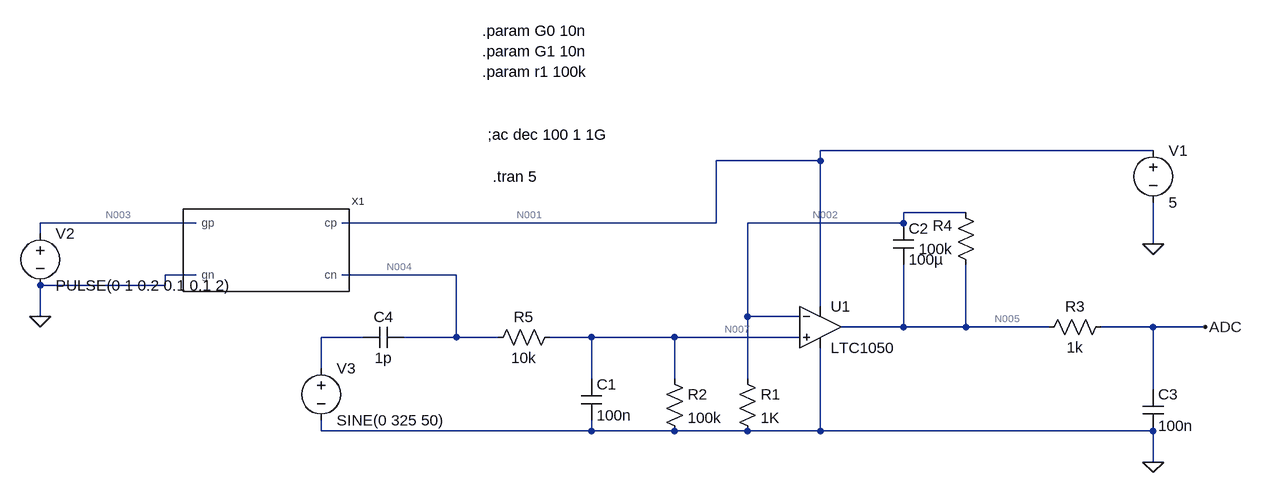
[diagram p0: schematic projet_symbol.asc]
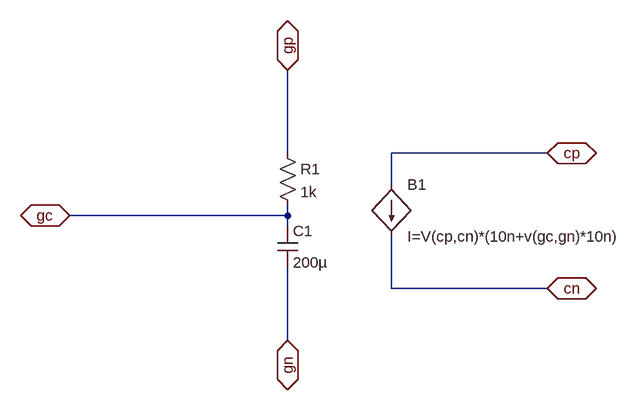
[diagram p1: sub-circuit symbole.asc]
projet_symbol.asc, the LTspice schematic file:
Version 4
SHEET 1 880 680
WIRE 720 -112 208 -112
WIRE 208 -96 208 -112
WIRE 208 -96 48 -96
WIRE 432 -16 336 -16
WIRE -752 0 -992 0
WIRE 48 0 48 -96
WIRE 48 0 -528 0
WIRE 336 0 336 -16
WIRE 336 0 96 0
WIRE -992 16 -992 0
WIRE 720 32 720 -32
WIRE -752 80 -800 80
WIRE -352 80 -528 80
WIRE -800 96 -800 80
WIRE -800 96 -992 96
WIRE 208 128 208 -96
WIRE -992 144 -992 96
WIRE 96 144 96 0
WIRE 176 144 96 144
WIRE 336 160 336 64
WIRE 336 160 240 160
WIRE 432 160 432 64
WIRE 432 160 336 160
WIRE 560 160 432 160
WIRE 720 160 640 160
WIRE 800 160 720 160
WIRE -496 176 -560 176
WIRE -352 176 -352 80
WIRE -352 176 -432 176
WIRE -288 176 -352 176
WIRE -144 176 -208 176
WIRE -16 176 -144 176
WIRE 176 176 -16 176
WIRE -560 224 -560 176
WIRE -144 240 -144 176
WIRE -16 240 -16 176
WIRE 96 240 96 144
WIRE 720 256 720 160
WIRE -560 320 -560 304
WIRE -144 320 -144 304
WIRE -144 320 -560 320
WIRE -16 320 -144 320
WIRE 96 320 -16 320
WIRE 208 320 208 192
WIRE 208 320 96 320
WIRE 720 320 208 320
WIRE 720 368 720 320
FLAG 720 368 0
FLAG 720 32 0
FLAG 800 160 ADC
FLAG -992 144 0
SYMBOL OpAmps\\LTC1050 208 96 R0
SYMATTR InstName U1
SYMBOL res 80 224 R0
SYMATTR InstName R1
SYMATTR Value 1K
SYMBOL res -32 224 R0
SYMATTR InstName R2
SYMATTR Value 100k
SYMBOL res 656 144 R90
WINDOW 0 0 56 VBottom 2
WINDOW 3 32 56 VTop 2
SYMATTR InstName R3
SYMATTR Value 1k
SYMBOL res 448 80 R180
WINDOW 0 36 76 Left 2
WINDOW 3 36 40 Left 2
SYMATTR InstName R4
SYMATTR Value 100k
SYMBOL res -304 192 R270
WINDOW 0 32 56 VTop 2
WINDOW 3 0 56 VBottom 2
SYMATTR InstName R5
SYMATTR Value 10k
SYMBOL cap -160 240 R0
SYMATTR InstName C1
SYMATTR Value 100n
SYMBOL cap 320 0 R0
SYMATTR InstName C2
SYMATTR Value 100µ
SYMBOL cap 704 256 R0
SYMATTR InstName C3
SYMATTR Value 100n
SYMBOL voltage 720 -128 R0
WINDOW 123 0 0 Left 0
WINDOW 39 0 0 Left 0
SYMATTR InstName V1
SYMATTR Value 5
SYMBOL voltage -992 0 R0
WINDOW 123 0 0 Left 0
WINDOW 39 0 0 Left 0
SYMATTR InstName V2
SYMATTR Value PULSE(0 1 0.2 0.1 0.1 2)
SYMBOL voltage -560 208 R0
WINDOW 123 0 0 Left 0
WINDOW 39 0 0 Left 0
SYMATTR InstName V3
SYMATTR Value SINE(0 325 50)
SYMBOL cap -432 160 R90
WINDOW 0 0 32 VBottom 2
WINDOW 3 32 32 VTop 2
SYMATTR InstName C4
SYMATTR Value 1p
SYMBOL symbole -672 32 R0
SYMATTR InstName X1
TEXT -296 -72 Left 2 !.tran 5
TEXT -304 -136 Left 2 !;ac dec 100 1 1G
TEXT -312 -296 Left 2 !.param G0 10n\n.param G1 10n\n.param r1 100k

symbole.asc, the sub-circuit schematic file:
Version 4
SHEET 1 880 680
WIRE 16 80 16 -48
WIRE 416 80 176 80
WIRE 176 128 176 80
WIRE 16 176 16 160
WIRE 16 176 -320 176
WIRE 16 192 16 176
WIRE 176 288 176 208
WIRE 416 288 176 288
WIRE 16 368 16 256
FLAG 416 288 cn
IOPIN 416 288 BiDir
FLAG 416 80 cp
IOPIN 416 80 BiDir
FLAG 16 368 gn
IOPIN 16 368 BiDir
FLAG 16 -48 gp
IOPIN 16 -48 BiDir
FLAG -320 176 gc
IOPIN -320 176 BiDir
SYMBOL res 0 64 R0
SYMATTR InstName R1
SYMATTR Value 1k
SYMBOL cap 0 192 R0
SYMATTR InstName C1
SYMATTR Value 200µ
SYMBOL bi 176 128 R0
SYMATTR InstName B1
SYMATTR Value I=V(cp,cn)*(10n+v(gc,gn)*10n)

The netlist it stands for:
* projet_symbol.asc
XU1 N007 N002 N001 0 N005 LTC1050  ; pins In+ In- V+ V- OUT
R1 N002 0 1K
R2 N007 0 100k
R3 ADC N005 1k
R4 N005 N002 100k
R5 N004 N007 10k
C1 N007 0 100n
C2 N002 N005 100µ
C3 ADC 0 100n
V1 N001 0 5
V2 N003 0 PULSE(0 1 0.2 0.1 0.1 2)
V3 N006 0 SINE(0 325 50)
C4 N004 N006 1p
XX1 N001 N004 N003 0 symbole

* block symbol definitions
.subckt symbole cp cn gp gn
R1 gp gc 1k
C1 gc gn 200µ
B1 cp cn I=V(cp,cn)*(10n+v(gc,gn)*10n)
.ends symbole

.tran 5
;ac dec 100 1 1G
.param G0 10n
.param G1 10n
.param r1 100k
.lib LTC.lib
.backanno
.end

* Results of the author's LTspice run, read from the files saved beside the schematic
* Operating Point, zero values left out:
*   V(n002) = 4.995 mV
*   V(n007) = 4.995 mV
*   V(n001) = 5 V
*   V(n005) = 504.4 mV
*   V(adc) = 504.4 mV
*   V(n004) = 5.494 mV
*   I(R1) = 4.995 µA
*   I(R2) = 49.95 nA
*   I(R4) = 4.995 µA
*   I(R5) = 49.95 nA
*   I(V1) = -754.2 µA
*   Ix(u1:3) = 754.1 µA
*   Ix(u1:4) = -749.1 µA
*   Ix(u1:5) = -4.995 µA
*   Ix(x1:CP) = 49.95 nA
*   Ix(x1:CN) = -49.95 nA
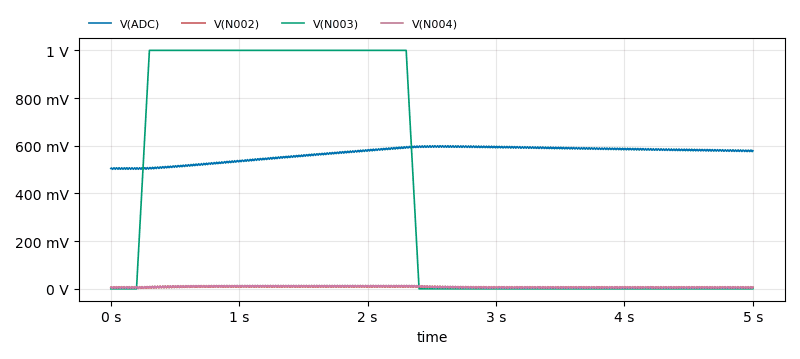
[diagram p2: Transient Analysis of projet_symbol.asc, plotted from the saved traces]
* Transient Analysis, 1 run:
*   V(ADC): min 501.2 mV, max 600 mV, average 567.9 mV, rms 568.7 mV, last 579.2 mV
*   V(N002): min 1.679 mV, max 13.06 mV, average 7.086 mV, rms 7.742 mV, last 5.929 mV
*   V(N003): min 0 V, max 1 V, average 420 mV, rms 642.9 mV, last 0 V
*   V(N004): min 1.783 mV, max 14.45 mV, average 7.795 mV, rms 8.543 mV, last 7.462 mV